# EAGLE design ArduinoShield (EAGLE 7.3.0)
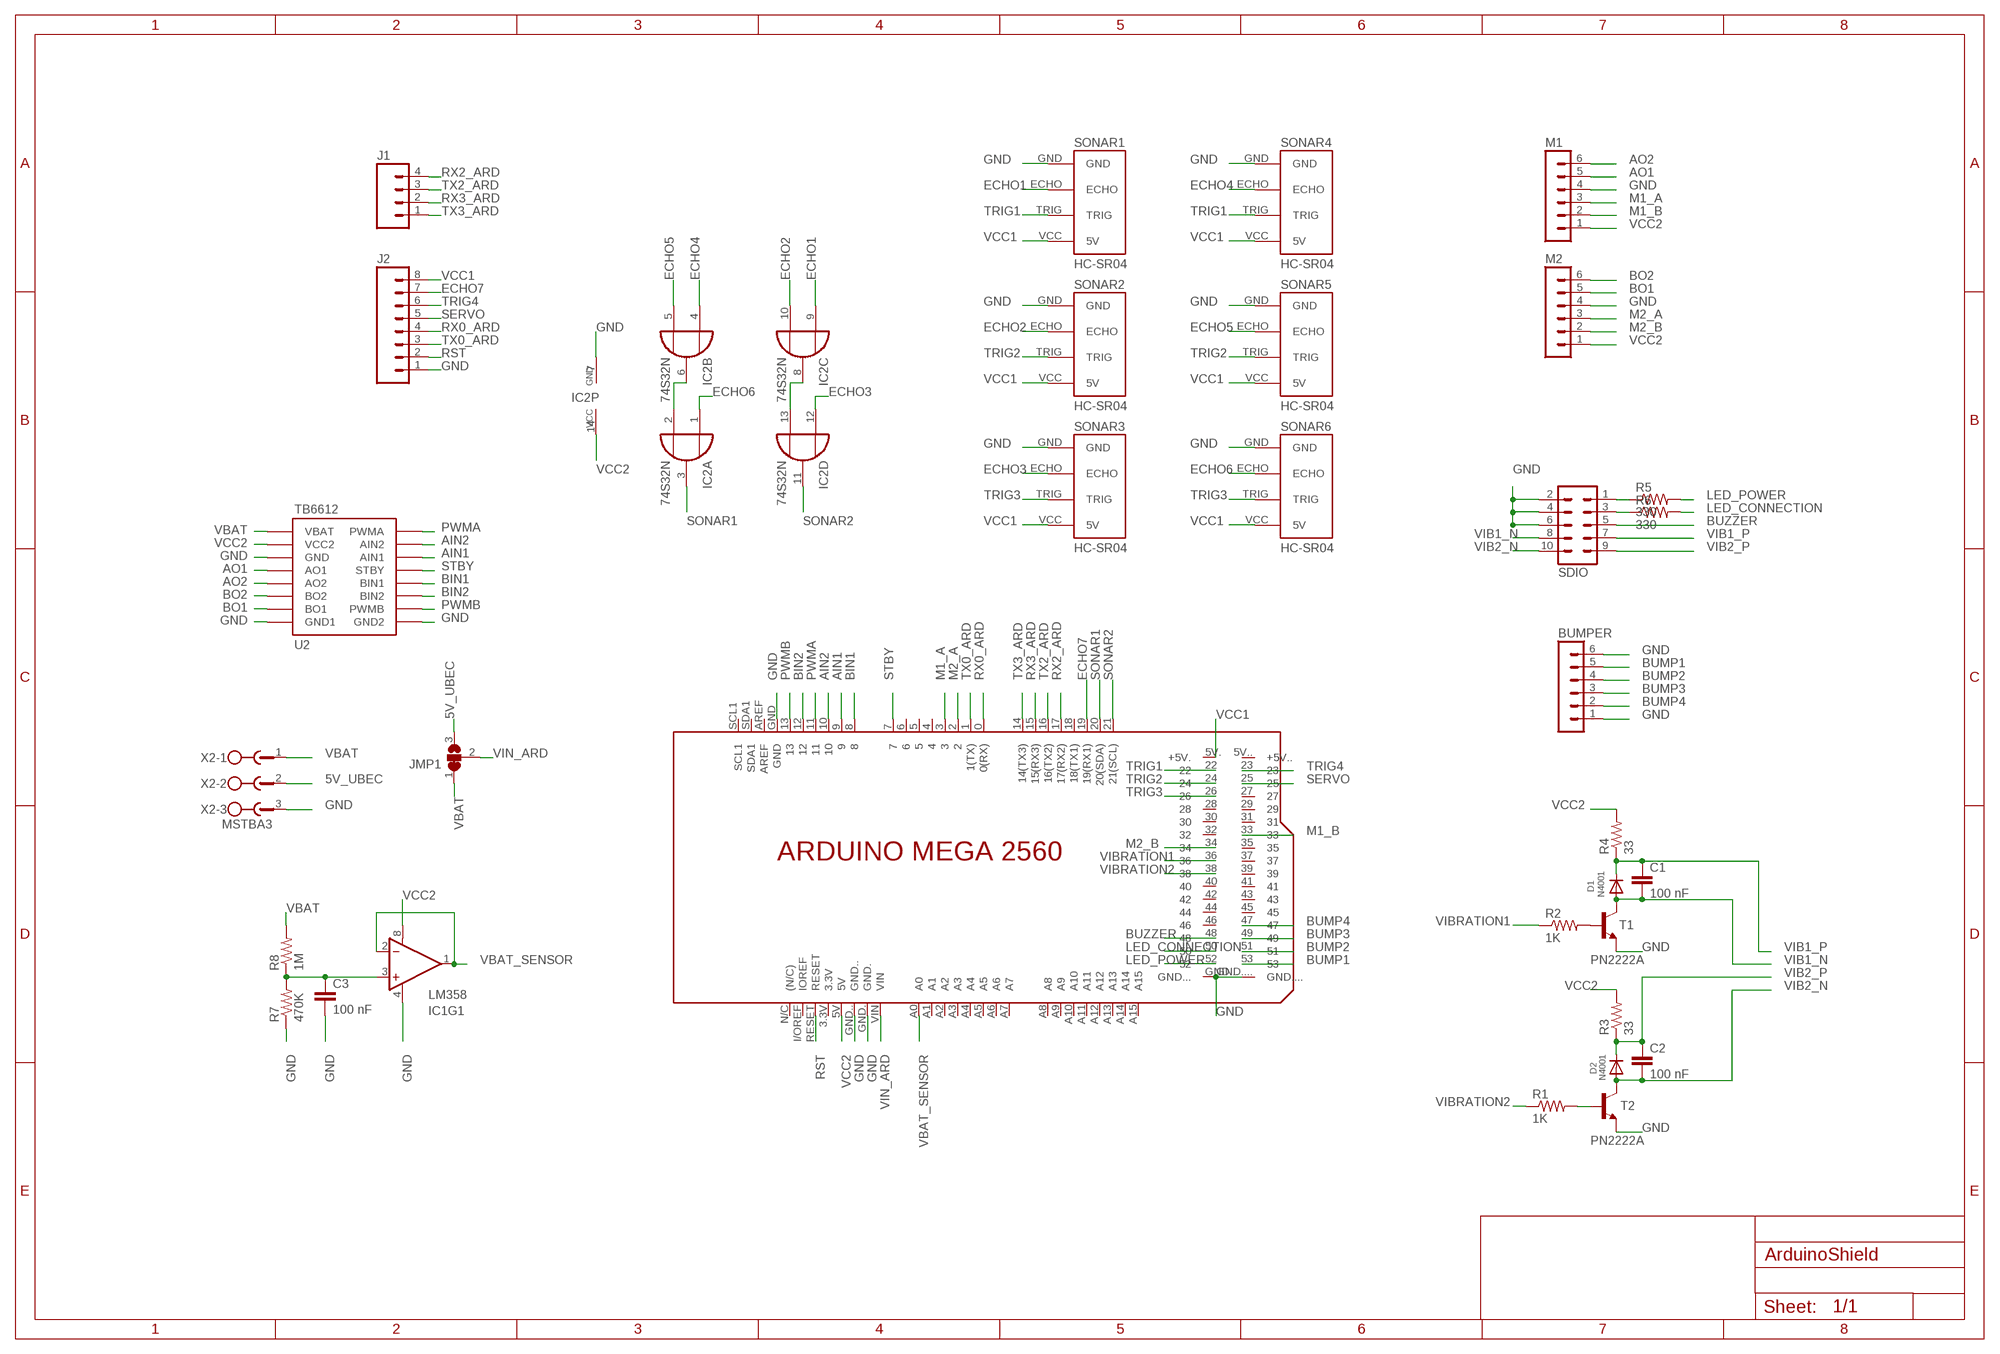
[diagram p0: schematic, sheet 1]

## Parts
BUMPER  MA06-1  [MA06-1]
C1  100 nF  C5/2.5  [C5B2.5]
C2  100 nF  C5/2.5  [C5B2.5]
C3  100 nF  C5/2.5  [C5B2.5]
D1  N4001  DIODEDO-1N4148  [DO-1N4148]
D2  N4001  DIODEDO-1N4148  [DO-1N4148]
IC1  LM358  [DIP08]
IC2  74S32N  [DIL14]
J1  M04PTH  [1X04]
J2  M08SILK_FEMALE_PTH  [1X08]
JMP1  SJ2W  [SJ_2]
M1  MA06-1  [MA06-1]
M2  MA06-1  [MA06-1]
PCB1  ARDUINO_MEGA2560  [ARDUINO_MEGA2560]
R1  1K  R-US_0207/2V  [0207/2V]
R2  1K  R-US_0207/2V  [0207/2V]
R3  33  R-US_0207/2V  [0207/2V]
R4  33  R-US_0207/2V  [0207/2V]
R5  330  R-US_0207/2V  [0207/2V]
R6  330  R-US_0207/2V  [0207/2V]
R7  470K  R-US_0207/2V  [0207/2V]
R8  1M  R-US_0207/2V  [0207/2V]
SDIO  MA05-2  [MA05-2]
SONAR1  HC-SR04  [HC-SR04_FOOTPRINT]
SONAR2  HC-SR04  [HC-SR04_FOOTPRINT]
SONAR3  HC-SR04  [HC-SR04_FOOTPRINT]
SONAR4  HC-SR04  [HC-SR04_FOOTPRINT]
SONAR5  HC-SR04  [HC-SR04_FOOTPRINT]
SONAR6  HC-SR04  [HC-SR04_FOOTPRINT]
T1  PN2222A  2N2222  [TO92-EBC-OVAL]
T2  PN2222A  2N2222  [TO92-EBC-OVAL]
U2  TB6612  [TB6612]
X2  MSTBA3  [MSTBA3]

## Nets
5V_UBEC: JMP1.3 X2.2
AIN1: PCB1.9 U2.P$14(AIN1)
AIN2: PCB1.10 U2.P$15(AIN2)
AO1: M1.5 U2.P$4(AO1)
AO2: M1.6 U2.P$5(AO2)
BIN1: PCB1.8 U2.P$12(BIN1)
BIN2: PCB1.12 U2.P$11(BIN2)
BO1: M2.5 U2.P$7(BO1)
BO2: M2.6 U2.P$6(BO2)
BUMP1: BUMPER.5 PCB1.53
BUMP2: BUMPER.4 PCB1.51
BUMP3: BUMPER.3 PCB1.49
BUMP4: BUMPER.2 PCB1.47
BUZZER: PCB1.48 SDIO.5
ECHO1: IC2.9(C:I0) SONAR1.ECHO
ECHO2: IC2.10(C:I1) SONAR2.ECHO
ECHO3: IC2.12(D:I0) SONAR3.ECHO
ECHO4: IC2.4(B:I0) SONAR4.ECHO
ECHO5: IC2.5(B:I1) SONAR5.ECHO
ECHO6: IC2.1(A:I0) SONAR6.ECHO
ECHO7: J2.7 PCB1.19(19(RX1))
GND: BUMPER.1 BUMPER.6 C3.2 IC1.4(V-) IC2.7(P:GND) J2.1 M1.4 M2.4 PCB1.GND PCB1.GND. PCB1.GND.. PCB1.GND... PCB1.GND.... R7.1 SDIO.2 SDIO.4 SDIO.6 SONAR1.GND SONAR2.GND SONAR3.GND SONAR4.GND SONAR5.GND SONAR6.GND T1.E T2.E U2.P$3(GND) U2.P$8(GND1) U2.P$9(GND2) X2.3
LED_CONNECTION: PCB1.50 R6.2
LED_POWER: PCB1.52 R5.2
M1_A: M1.3 PCB1.3
M1_B: M1.2 PCB1.33
M2_A: M2.3 PCB1.2
M2_B: M2.2 PCB1.34
N$1: R2.2 T1.B
N$4: IC2.2(A:I1) IC2.6(B:O)
N$5: R1.2 T2.B
N$8: IC2.8(C:O) IC2.13(D:I1)
N$11: R5.1 SDIO.1
N$12: R6.1 SDIO.3
N$13: C3.1 IC1.3(+IN) R7.2 R8.1
PWMA: PCB1.11 U2.P$16(PWMA)
PWMB: PCB1.13 U2.P$10(PWMB)
RST: J2.2 PCB1.RESET
RX0_ARD: J2.4 PCB1.0(0(RX))
RX2_ARD: J1.4 PCB1.17(17(RX2))
RX3_ARD: J1.2 PCB1.15(15(RX3))
SERVO: J2.5 PCB1.25
SONAR1: IC2.3(A:O) PCB1.20(20(SDA))
SONAR2: IC2.11(D:O) PCB1.21(21(SCL))
STBY: PCB1.7 U2.P$13(STBY)
TRIG1: PCB1.22 SONAR1.TRIG SONAR4.TRIG
TRIG2: PCB1.24 SONAR2.TRIG SONAR5.TRIG
TRIG3: PCB1.26 SONAR3.TRIG SONAR6.TRIG
TRIG4: J2.6 PCB1.23
TX0_ARD: J2.3 PCB1.1(1(TX))
TX2_ARD: J1.3 PCB1.16(16(TX2))
TX3_ARD: J1.1 PCB1.14(14(TX3))
VBAT: JMP1.1 R8.2 U2.P$1(VBAT) X2.1
VBAT_SENSOR: IC1.1(OUT) IC1.2(-IN) PCB1.A0
VCC1: J2.8 PCB1.5V.(+5V.) SONAR1.VCC(5V) SONAR2.VCC(5V) SONAR3.VCC(5V) SONAR4.VCC(5V) SONAR5.VCC(5V) SONAR6.VCC(5V)
VCC2: IC1.8(V+) IC2.14(P:VCC) M1.1 M2.1 PCB1.5V R3.2 R4.2 U2.P$2(VCC2)
VIB1_N: C1.2 D1.A SDIO.8 T1.C
VIB1_P: C1.1 D1.C R4.1 SDIO.7
VIB2_N: C2.2 D2.A SDIO.10 T2.C
VIB2_P: C2.1 D2.C R3.1 SDIO.9
VIBRATION1: PCB1.36 R2.1
VIBRATION2: PCB1.38 R1.1
VIN_ARD: JMP1.2 PCB1.VIN
Unconnected: IC1.5(+IN) IC1.6(-IN) IC1.7(OUT) PCB1.3.3V PCB1.4 PCB1.5 PCB1.5V..(+5V..) PCB1.6 PCB1.18(18(TX1)) PCB1.27 PCB1.28 PCB1.29 PCB1.30 PCB1.31 PCB1.32 PCB1.35 PCB1.37 PCB1.39 PCB1.40 PCB1.41 PCB1.42 PCB1.43 PCB1.44 PCB1.45 PCB1.46 PCB1.A1 PCB1.A2 PCB1.A3 PCB1.A4 PCB1.A5 PCB1.A6 PCB1.A7 PCB1.A8 PCB1.A9 PCB1.A10 PCB1.A11 PCB1.A12 PCB1.A13 PCB1.A14 PCB1.A15 PCB1.AREF PCB1.I/OREF(IOREF) PCB1.N/C((N/C)) PCB1.SCL1 PCB1.SDA1

## Library data of the parts
BUMPER M1 M2 = con-lstb:MA06-1: PIN HEADER; OC_FARNELL: unknown; OC_NEWARK: unknown
C1-C3 = capacitor-wima:C: CAPACITOR naming: grid - package width
D1 D2 = adafruit:DIODE: Diode SMADIODE - SMA Surface Mount Package 20V 1A Schottky Diode Digikey: 641-1014-6-ND DO-1N4148 - Through Hole Small Current Diode SOD-123 20V 1 A (.5mV Vf) Schottky Diode - Digikey: MBRX120TPMSCT-ND SOD-323 10V 570mA (.38mV Vf, 3ns) Schottky Diode - Digikey: ZLLS410CT-ND SOD-523 30V 30mA Schottky Diode (RB751S-40TE61) - Digikey: RB751S-40TE61CT-ND SOT23-R/W - SOT23 Package (R = Solder Paste/Reflow Ovens, W = Hand-Soldering) BAT54Film 40V 300mA - Digikey: 497-7162-1-ND
IC1 = SparkFun-AnalogIC:LM358: Jellybean op-amp; PROD_ID: IC-09172
IC2 = 74xx-eu:74*32: Quad 2-input OR gate
J1 = SparkFun-Connectors:M04: Header 4 Standard 4-pin 0.1" header. Use with straight break away headers (SKU : PRT-00116), right angle break away headers (PRT-00553), swiss pins (PRT-00743), machine pins (PRT-00117), and female headers (PRT-00115). Molex polarized connector foot print use with SKU : PRT-08231 with associated crimp pins and housings. 1MM SMD Version SKU: PRT-10208
J2 = SparkFun-Connectors:M08: Header 8 Standard 8-pin 0.1" header. Use with straight break away headers (SKU : PRT-00116), right angle break away headers (PRT-00553), swiss pins (PRT-00743), machine pins (PRT-00117), and female headers (PRT-00115).; PROD_ID: CONN-08438
JMP1 = jumper:SJ2W: SMD solder JUMPER
PCB1 = E14_Arduino_revB:ARDUINO_MEGA2560: Device for representing an Arduino Mega 2560 board with a footprint in an EAGLE design. Created by Dave Young for Element14. More EAGLE documentation at: http://www.element14.com/community/community/knode/cadsoft_eagle
R1-R8 = adafruit:R-US_: RESISTOR, American symbol
SDIO = con-lstb:MA05-2: PIN HEADER; OC_FARNELL: unknown; OC_NEWARK: unknown
SONAR1-SONAR6 = Ultrasonic Sensor HC-SR04:HC-SR04: Ultrasonic Sensor HC-SR04
T1 T2 = adafruit:2N2222: NPN TRANSISTOR Big oval pads
U2 = tb6612:TB6612
X2 = con-phoenix-508:MSTBA3: PHOENIX; MF: FARNELL; MPN: 1757255; OC_FARNELL: 3705183; OC_NEWARK: 71C4162

## Board
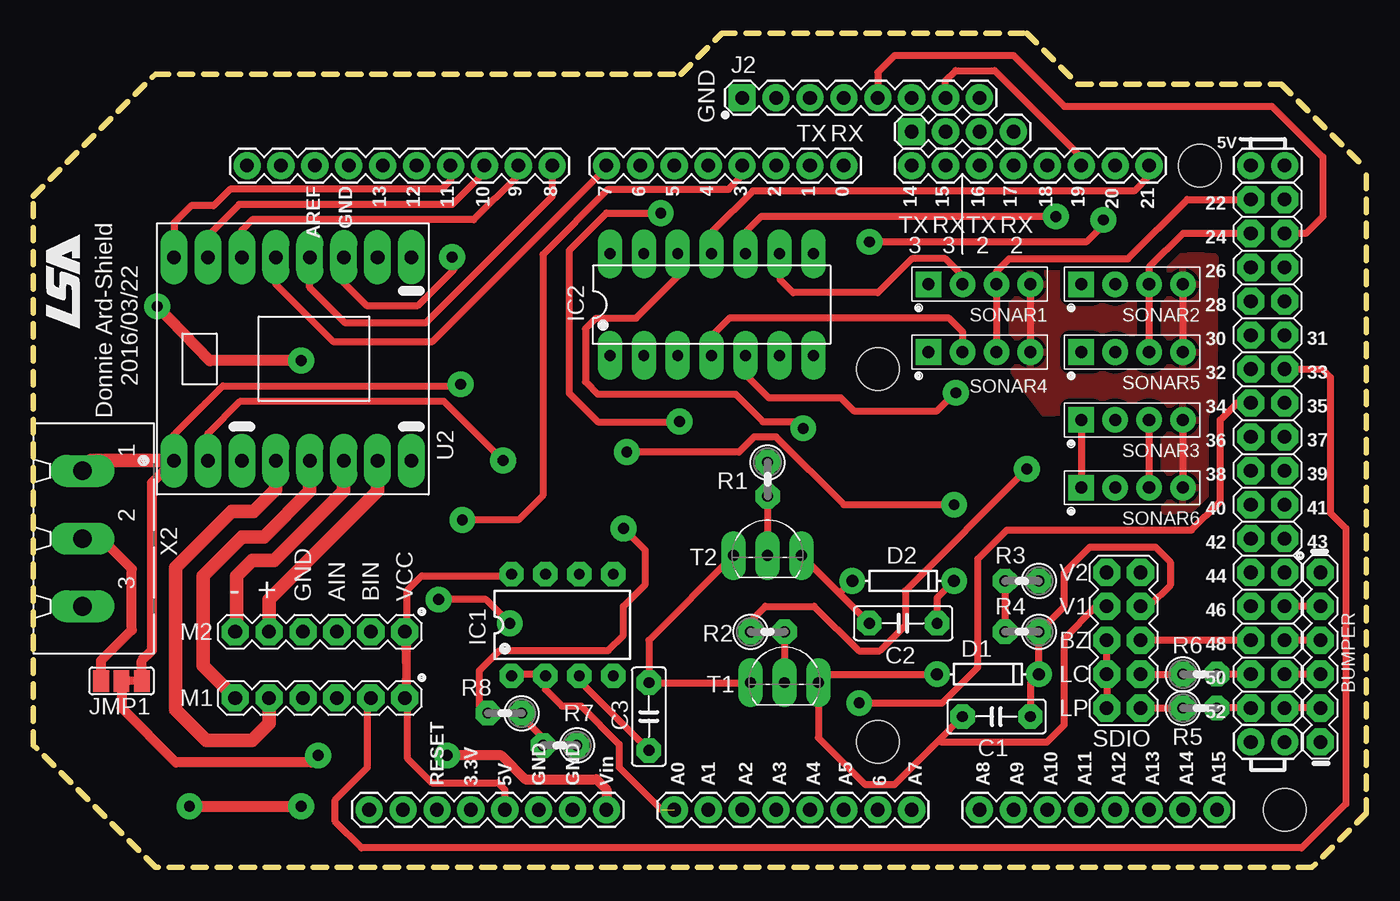
[diagram p1: board, top side]
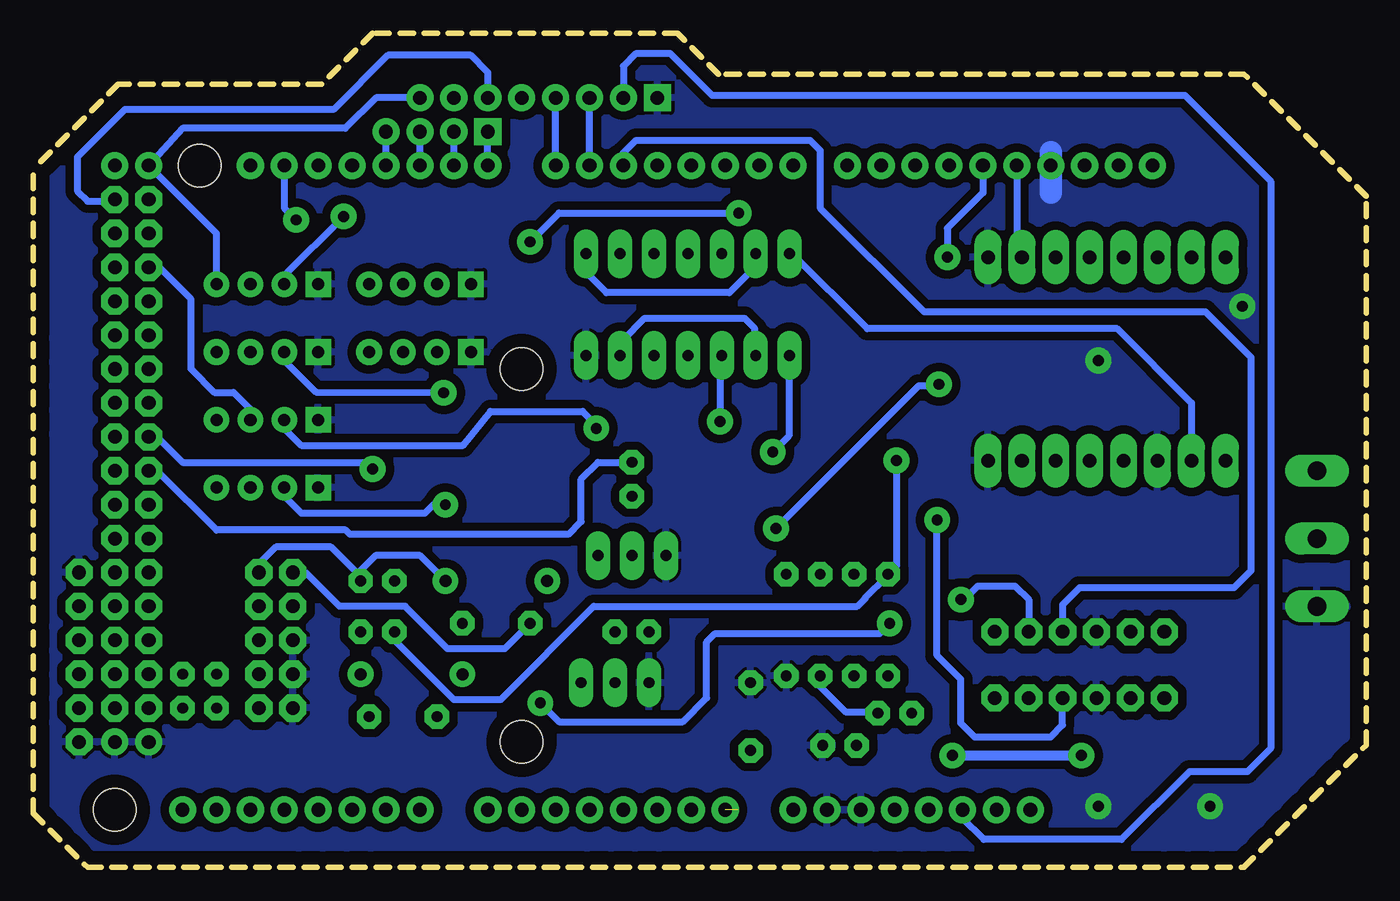
[diagram p2: board, bottom side, seen from below]

Size 99.82 x 62.48 mm. Coordinates in mm from the lower left corner, seen from the top.
Outline: 51.56,62.48 74.42,62.48 78.23,58.67 93.47,58.67 99.82,52.32 99.82,4.06 95.76,0 9.14,0 0,9.14 0,50.29 9.14,59.44 48.51,59.44 51.56,62.48
Copper layers (1*16): Top 0.035mm / dielectric 1.5mm / Bottom 0.035mm
Design rules "default *": minimum track width 20mil, minimum drill 24mil, track to track 25mil, track to pad 25mil, pad to pad 20mil, via to via 20mil, smd to smd 20mil, copper to edge 40mil, drill to drill 8mil, minimum pad ring 20mil, minimum via ring 8mil, stop-mask expansion 4mil, vias tented up to drill 0mil, thermal gap 10mil

### Footprints (pad centres in the part's own frame; a part is rotated, then mirrored left to right if it is on the bottom)
MA06-1 = drill 1.016 pad 1.93 octagon: 1 -6.35,0; 2 -3.81,0; 3 -1.27,0; 4 1.27,0; 5 3.81,0; 6 6.35,0
C5B2.5 = drill 0.813 pad 1.6 octagon: 1 -2.54,0; 2 2.54,0
DO-1N4148 = drill 0.9: A -3.81,0; C 3.81,0
DIP08 = drill 0.813 pad 1.727 octagon: 1 -3.81,-3.81; 2 -1.27,-3.81; 3 1.27,-3.81; 4 3.81,-3.81; 5 3.81,3.81; 6 1.27,3.81; 7 -1.27,3.81; 8 -3.81,3.81
DIL14 = drill 0.813 long: 1 -7.62,-3.81; 2 -5.08,-3.81; 3 -2.54,-3.81; 4 0,-3.81; 5 2.54,-3.81; 6 5.08,-3.81; 7 7.62,-3.81; 8 7.62,3.81; 9 5.08,3.81; 10 2.54,3.81; 11 0,3.81; 12 -2.54,3.81; 13 -5.08,3.81; 14 -7.62,3.81
1X04 = drill 1.016 pad 1.88 square: 1 0,0 | drill 1.016 pad 1.88: 2 2.54,0; 3 5.08,0; 4 7.62,0
1X08 = drill 1.016 pad 1.88 square: 1 0,0 | drill 1.016 pad 1.88: 2 2.54,0; 3 5.08,0; 4 7.62,0; 5 10.16,0; 6 12.7,0; 7 15.24,0; 8 17.78,0
SJ_2 = smd 1.168 x 1.6: 1 -1.524,0; 2 0,0; 3 1.524,0
ARDUINO_MEGA2560 = drill 1.016 pad 1.88: 0 63.5,50.8; 1 60.96,50.8; 2 58.42,50.8; 3 55.88,50.8; 3.3V 35.56,2.54; 4 53.34,50.8; 5 50.8,50.8; 5V 38.1,2.54; 5V. 93.98,50.8; 5V.. 96.52,50.8; 6 48.26,50.8; 7 45.72,50.8; 8 41.656,50.8; 9 39.116,50.8; 10 36.576,50.8; 11 34.036,50.8; 12 31.496,50.8; 13 28.956,50.8; 14 68.58,50.8; 15 71.12,50.8; 16 73.66,50.8; 17 76.2,50.8; 18 78.74,50.8; 19 81.28,50.8; 20 83.82,50.8; 21 86.36,50.8; A0 50.8,2.54; A1 53.34,2.54; A2 55.88,2.54; A3 58.42,2.54; A4 60.96,2.54; A5 63.5,2.54; A6 66.04,2.54; A7 68.58,2.54; A8 73.66,2.54; A9 76.2,2.54; A10 78.74,2.54; A11 81.28,2.54; A12 83.82,2.54; A13 86.36,2.54; A14 88.9,2.54; A15 91.44,2.54; AREF 23.876,50.8; GND 26.416,50.8; GND. 43.18,2.54; GND.. 40.64,2.54; GND... 93.98,7.62; GND.... 96.52,7.62; I/OREF 30.48,2.54; N/C 27.94,2.54; RESET 33.02,2.54; SCL1 18.796,50.8; SDA1 21.336,50.8; VIN 45.72,2.54 | drill 1.016 pad 1.88 octagon: 22 93.98,48.26; 23 96.52,48.26; 24 93.98,45.72; 25 96.52,45.72; 26 93.98,43.18; 27 96.52,43.18; 28 93.98,40.64; 29 96.52,40.64; 30 93.98,38.1; 31 96.52,38.1; 32 93.98,35.56; 33 96.52,35.56; 34 93.98,33.02; 35 96.52,33.02; 36 93.98,30.48; 37 96.52,30.48; 38 93.98,27.94; 39 96.52,27.94; 40 93.98,25.4; 41 96.52,25.4; 42 93.98,22.86; 43 96.52,22.86; 44 93.98,20.32; 45 96.52,20.32; 46 93.98,17.78; 47 96.52,17.78; 48 93.98,15.24; 49 96.52,15.24; 50 93.98,12.7; 51 96.52,12.7; 52 93.98,10.16; 53 96.52,10.16 | hole 3.2: 66.04,35.56; 66.04,7.62; 90.17,50.8; 96.52,2.54
0207/2V = drill 0.813 pad 1.676 octagon: 1 -1.27,0; 2 1.27,0
MA05-2 = drill 1.016 octagon: 1 -5.08,-1.27; 2 -5.08,1.27; 3 -2.54,-1.27; 4 -2.54,1.27; 5 0,-1.27; 6 0,1.27; 7 2.54,-1.27; 8 2.54,1.27; 9 5.08,-1.27; 10 5.08,1.27
HC-SR04_FOOTPRINT = drill 0.9 pad 1.778: ECHO 0,1.27; TRIG 0,-1.27; VCC 0,-3.81 | drill 0.9 pad 1.778 square: GND 0,3.81
TO92-EBC-OVAL = drill 0.813 long: B 0,-1.27; C 2.54,-1.27; E -2.54,-1.27
TB6612 = drill 1.016 pad 2.032 long: P$1 0,0; P$2 0,-2.54; P$3 0,-5.08; P$4 0,-7.62; P$5 0,-10.16; P$6 0,-12.7; P$7 0,-15.24; P$8 0,-17.78; P$9 15.24,-17.78; P$10 15.24,-15.24; P$11 15.24,-12.7; P$12 15.24,-10.16; P$13 15.24,-7.62; P$14 15.24,-5.08; P$15 15.24,-2.54; P$16 15.24,0
MSTBA3 = drill 1.397 long: 1 -5.08,5.08; 2 0,5.08; 3 5.08,5.08

### Placement (x,y rotation side)
BUMPER  96.39,15.75 270 top
C1  72.14,11.3 180 top
C2  65.15,18.29 180 top
C3  46.1,11.3 90 top
D1  71.5,14.48 0 top
D2  65.15,21.46 0 top
IC1  39.62,18.16 0 top
IC2  50.8,42.16 0 top
J1  65.79,55.12 0 top
J2  53.09,57.66 0 top
JMP1  6.6,13.97 180 top
M1  21.46,12.7 180 top
M2  21.46,17.65 180 top
PCB1  -2.79,1.78 0 top
R1  54.99,29.08 270 top
R2  54.99,17.65 0 top
R3  74.04,21.46 180 top
R4  74.04,17.65 180 top
R5  87.38,11.94 0 top
R6  87.38,14.48 0 top
R7  39.43,9.14 180 top
R8  35.31,11.56 180 top
SDIO  81.66,17.02 90 top
SONAR1  70.87,43.69 90 top
SONAR2  82.3,43.69 90 top
SONAR3  82.3,33.53 90 top
SONAR4  70.87,38.61 90 top
SONAR5  82.3,38.61 90 top
SONAR6  82.3,28.45 90 top
T1  56.26,15.11 0 top
T2  54.99,24.64 0 top
U2  10.54,30.48 90 top
X2  -1.4,24.64 270 top

### Tracks (layer width: path | path; a pad name or v marks a point on that pad's centre or on a via)
5V_UBEC
  Top 0.762: JMP1.3 5.08,15.49 7.37,17.78 7.37,22.35 5.08,24.64 X2.2
AIN1
  Top 0.508: U2.P$14 15.62,47.75 16.38,48.51 32.99,48.51 36.26,51.78 36.26,52.52 PCB1.9
AIN2
  Top 0.508: PCB1.10 33.78,52.07 31.37,49.66 15.4,49.66 13.08,47.34 U2.P$15
AO1
  Top 1.016: U2.P$4 18.16,28.32 16.51,26.67 14.86,26.67 10.67,22.48 10.67,11.81 12.95,9.52 16.38,9.52 17.65,10.8 M1.5
AO2
  Top 1.016: U2.P$5 20.7,28.19 17.27,24.76 15.62,24.76 12.7,21.84 12.7,15.11 M1.6
BIN1
  Top 0.508: U2.P$12 20.7,43.43 23.3,40.83 29.43,40.83 38.86,50.26 PCB1.8
BIN2  (via drill 0.81 pad 1.93)
  Top 0.508: U2.P$11 23.24,43.81 24.96,42.1 28.8,42.1 31.5,44.8 31.5,45.59 v31.37,45.72
  Bottom 0.508: PCB1.12 28.7,50.55 31.37,47.88 v31.37,45.72
BO1
  Top 1.016: U2.P$7 25.78,28.19 17.65,20.07 M2.5
BO2
  Top 1.016: U2.P$6 23.24,28.19 18.03,22.99 16.38,22.99 15.24,21.84 15.24,17.78 M2.6
BUMP1
  Top 0.508: BUMPER.5 PCB1.53
BUMP2
  Top 0.508: BUMPER.4 PCB1.51
BUMP3
  Top 0.508: BUMPER.3 PCB1.49
BUMP4
  Top 0.508: BUMPER.2 PCB1.47
BUZZER
  Top 0.508: PCB1.48 SDIO.5
ECHO1
  Top 0.508: SONAR1.ECHO 69.6,44.32 68.33,45.59 65.79,45.59 63.25,43.05 56.9,43.05 55.94,44.01 55.94,45.91 IC2.9
ECHO2  (via drill 0.81 pad 1.93)
  Top 0.508: v76.58,48.77 54.52,48.77 53.4,47.66 53.4,46.23 IC2.10
  Bottom 0.508: v76.58,48.77 81.03,44.32 SONAR2.ECHO
ECHO3  (via drill 0.81 pad 1.93)
  Top 0.508: v57.66,32.89 57.15,33.4 54.64,33.4 52.61,35.43 42.29,35.43 41.34,36.39 41.34,40.35 42.13,41.15 45.15,41.15 48.32,44.32 48.32,45.91 IC2.12
  Bottom 0.508: SONAR3.ECHO 81.03,32.89 79.76,31.62 67.63,31.62 65.59,34.16 58.67,34.16 57.66,33.15 v57.66,32.89
ECHO4
  Top 0.508: IC2.4 50.86,38.61 50.86,39.88 52.13,41.15 68.58,41.15 69.6,40.13 SONAR4.ECHO
ECHO5  (via drill 0.81 pad 1.93)
  Top 0.508: v69.09,35.56 67.63,34.16 61.5,34.16 60.48,35.18 55.09,35.18 53.4,36.86 53.4,38.29 IC2.5
  Bottom 0.508: SONAR5.ECHO 81.03,37.97 78.68,35.62 v69.09,35.56
ECHO6  (via drill 0.81 pad 1.93)
  Top 0.508: 68.71,27.18 v68.96,27.18 60.71,27.18 55.63,32.26 53.98,32.26 52.83,31.11 v44.45,31.11
  Bottom 0.508: SONAR6.ECHO 81.03,27.81 79.76,26.54 70.48,26.54 69.85,27.18 v68.96,27.18 | IC2.1 43.24,38.29 43.24,32.32 v44.45,31.11
ECHO7
  Top 0.508: PCB1.19 78.49,53.21 72.01,59.69 69.09,59.69 68.33,58.93 J2.7
GND  (via drill 0.81 pad 1.93)
  Top 0.508: SONAR3.GND SONAR6.GND | SDIO.2 SDIO.4 SDIO.6 | T1.E C3.2 46.1,17.02 T2.E
  Top 0.813: v11.68,4.57 v20.07,4.57 | v20.07,37.97 13.21,37.97 v9.27,42.04
  Bottom 1.676: 23.62,53.59 PCB1.GND 23.62,50.55
  pour Bottom: 0.1,50.2 0.25,9.14 9.14,0.25 95.76,0.25 99.57,4.19 99.57,26.29 98.55,27.31 98.55,53.21 93.34,58.45 78.11,58.52 74.39,62.26 51.72,62.23 48.64,59.21 9.14,59.18
LED_CONNECTION
  Top 0.508: PCB1.50 R6.2
LED_POWER
  Top 0.508: PCB1.52 R5.2
M1_A  (via drill 0.81 pad 1.93)
  Top 0.508: PCB1.3 53.09,51.82 52.07,50.8 43.05,50.8 38.16,45.91 38.16,27.88 36.32,26.04 v32.13,26.04
  Bottom 0.508: M1.3 22.73,10.67 23.62,9.78 29.34,9.78 30.35,10.8 30.35,14.1 32.13,15.88 v32.13,26.04
M1_B
  Top 0.508: PCB1.33 96.52,37.34 97.16,36.7 97.16,26.54 98.3,25.4 98.3,4.76 95,1.46 24.57,1.46 22.61,3.43 22.61,5.08 25.02,7.49 25.02,12.45 M1.2
M2_A
  Bottom 0.508: M2.3 22.73,19.68 21.46,20.96 9.91,20.96 8.64,22.22 8.64,38.23 12.03,41.62 33.12,41.62 40.89,49.4 40.89,53.72 41.66,54.48 54.67,54.48 55.63,53.53 PCB1.2
M2_B  (via drill 0.81 pad 1.93)
  Top 0.508: v61.85,12.32 68.07,12.32 70.74,14.99 70.74,23.11 72.9,25.27 86.74,25.27 88.9,27.43 88.9,33.53 90.17,34.8 PCB1.34 | v35.69,18.29 33.91,20.07 v30.35,20.07
  Bottom 0.508: 25.27,18.41 M2.2 25.27,20.07 26.29,21.08 29.08,21.08 30.1,20.07 v30.35,20.07 | v61.85,12.32 60.45,10.92 51.18,10.92 49.4,12.7 49.4,16.89 48.77,17.53 36.45,17.53 v35.69,18.29
N$1
  Top 0.508: R2.2 T1.B
N$4
  Bottom 0.508: IC2.2 45.78,38.61 45.78,40.35 46.58,41.15 54.04,41.15 55.63,39.56 55.63,38.61 IC2.6
N$5
  Top 0.508: R1.2 T2.B
N$8
  Bottom 0.508: IC2.13 45.78,45.91 45.78,44.96 47.69,43.05 56.9,43.05 58.17,44.32 58.17,45.91 IC2.8
N$11
  Top 0.508: SDIO.1 R5.1
N$12
  Top 0.508: SDIO.3 R6.1
N$13
  Top 0.508: R7.2 38.16,9.71 36.58,11.3 R8.1 | C3.1 40.89,13.97 IC1.3
  Bottom 0.508: R8.1 36.58,11.62 38.96,11.62 40.89,13.56 IC1.3
PWMA
  Top 0.508: PCB1.11 31.24,51.44 30.61,50.8 14.73,50.8 13.49,49.56 11.81,49.56 10.54,48.29 U2.P$16
PWMB
  Bottom 0.508: PCB1.13 26.16,46.1 U2.P$10
RST
  Bottom 0.508: PCB1.RESET 30.23,3.68 28.64,2.1 18.32,2.1 13.24,7.18 8.89,7.18 7.14,8.92 7.14,51.4 13.56,57.82 48.96,57.82 52.13,60.99 54.67,60.99 55.63,60.04 J2.2
RX0_ARD
  Bottom 0.508: PCB1.0 J2.4
RX2_ARD
  Bottom 0.508: PCB1.17 J1.4
RX3_ARD
  Bottom 0.508: PCB1.15 J1.2
SERVO
  Top 0.508: PCB1.25 95.31,47.5 96.58,48.77 96.58,53.21 92.77,57.02 77.22,57.02 73.41,60.83 64.52,60.83 63.25,59.56 J2.5
SONAR1  (via drill 0.81 pad 1.93)
  Top 0.508: v46.99,49.02 42.93,49.02 40.13,46.23 40.13,35.53 42.29,33.37 48.36,33.37 v48.39,33.4 | v80.14,48.51 80.14,48.13 78.87,46.86 v62.61,46.86
  Bottom 0.508: IC2.3 48.39,38.23 v48.39,33.4 | v46.99,49.02 60.45,49.02 v62.61,46.86 | PCB1.20 81.03,49.4 v80.14,48.51
SONAR2
  Top 0.508: IC2.11 50.86,46.23 50.86,47.66 53.88,50.67 82.45,50.67 83.57,51.78 PCB1.21
STBY
  Top 0.508: U2.P$13 18.16,43.69 22.45,39.4 29.91,39.4 42.45,51.94 42.45,52.1 PCB1.7
TRIG1
  Top 0.508: SONAR4.TRIG SONAR1.TRIG 72.14,44.64 73.09,45.59 81.98,45.59 86.42,50.04 PCB1.22
TRIG2
  Top 0.508: SONAR5.TRIG SONAR2.TRIG 83.57,44.96 86.11,47.5 PCB1.24
TRIG3
  Top 0.508: SONAR3.TRIG SONAR6.TRIG
  Bottom 0.508: PCB1.26 90.39,44.96 88.01,42.58 88.01,37.34 86.27,35.59 84.84,35.59 83.57,34.32 SONAR3.TRIG
TRIG4
  Bottom 0.508: PCB1.23 93.85,49.91 95.76,49.91 96.52,50.67 96.52,53.21 92.96,56.77 77.34,56.77 73.28,60.83 67.06,60.83 65.79,59.56 J2.6
TX0_ARD
  Bottom 0.508: PCB1.1 J2.3
TX2_ARD
  Bottom 0.508: PCB1.16 J1.3
TX3_ARD
  Bottom 0.508: PCB1.14 J1.1
VBAT  (via drill 0.81 pad 1.93)
  Top 0.508: v32,36.19 31.88,36.07 14.19,36.07 10.54,32.42 U2.P$1 | v44.2,25.4 45.85,23.75 45.85,21.21 44.2,19.56 44.2,17.4 43.05,16.26 34.93,16.26 33.4,14.73 33.4,12.1 33.94,11.56 R8.2
  Top 0.762: JMP1.1 8.13,15.49 8.89,16.26 8.89,28.83 U2.P$1
  Top 1.016: X2.1 4.32,30.48 U2.P$1
  Bottom 0.508: v44.2,25.4 33.53,36.07 32.13,36.07 v32,36.19
VBAT_SENSOR  (1 unrouted)
  Top 0.508: IC1.1 35.94,14.48 38.16,14.48 IC1.2 38.35,13.34 39.59,12.1 41.02,12.1 43.88,9.24 43.88,7.49 47.05,4.32
VCC1
  Top 0.508: SONAR3.VCC SONAR6.VCC | SONAR1.VCC SONAR4.VCC | SONAR2.VCC SONAR5.VCC
  Bottom 0.508: J2.8 74.17,57.66 76.45,55.37 88.65,55.37 PCB1.5V. 86.11,47.5 SONAR2.VCC
  pour Top: 73.28,44.96 73.28,37.34 74.17,36.07 75.69,34.04 84.2,34.42 84.71,26.67 87.63,26.92 88.39,26.92 88.52,45.72 87.25,45.85 73.41,45.21
VCC2  (via drill 0.81 pad 1.93)
  Top 0.508: R3.2 R4.2 | 35.62,21.78 IC1.8 35.69,21.84 29.08,21.84 28,20.76 28,17.65 M1.1 28,17.34 28,12.89 | 28,12.89 M2.1 | 28,12.89 28,8.19 29.85,6.35 34.8,6.35 35.31,5.84 PCB1.5V | U2.P$2 13.08,32.51 15.49,34.92 30.73,34.92 v35.18,30.48
  Bottom 0.508: 42.93,45.91 IC2.14 42.99,45.97 37.37,40.35 18.64,40.35 13.08,34.8 U2.P$2 | R4.2 72.77,17.02 68.33,12.57 64.83,12.57 57.85,19.56 38.1,19.56 37.53,20.13 37.53,20.19 35.94,21.78 IC1.8 35.18,22.61 v35.18,30.48
VIB1_N
  Top 0.508: 67.85,9.56 64.52,6.22 62.29,6.22 58.8,9.71 T1.C 59.44,14.48 D1.A | 67.85,9.56 C1.2 | 67.85,9.56 68.01,9.4 75.95,9.4 77.22,10.67 77.22,17.18 79.6,19.56 SDIO.8
VIB1_P
  Top 0.508: C1.1 74.68,13.84 D1.C R4.1 77.22,19.56 77.22,22.1 79.12,24 84.04,24 85.15,22.89 85.15,21.15 83.57,19.56 SDIO.7
VIB2_N
  Top 0.508: T2.C 60.39,20.51 | 60.39,20.51 C2.2 | 60.39,20.51 D2.A
  Bottom 0.508: C2.2 64.52,16.38 68.8,16.38 71.98,19.56 76.9,19.56 79.44,22.1 SDIO.10
VIB2_P
  Top 0.508: C2.1 67.69,20.19 D2.C
  Bottom 0.508: D2.C 70.87,23.37 74.2,23.37 75.55,22.02 | 75.55,22.02 75.31,21.78 R3.1 | 75.55,22.02 77.53,24 81.66,24 82.93,22.73 SDIO.9
VIBRATION1  (via drill 0.81 pad 1.93)
  Top 0.508: v74.42,29.85 65.31,20.73 65.31,18.13 63.41,16.22 61.82,16.22 58.48,19.56 54.83,19.56 53.72,18.45 R2.1
  Bottom 0.508: v74.42,29.85 74.93,30.35 88.65,30.35 90.55,32.26 PCB1.36
VIBRATION2
  Bottom 0.508: PCB1.38 90.55,29.72 86.11,25.27 76.42,25.27 76.11,24.96 59.75,24.96 58.8,25.91 58.8,29.08 57.53,30.35 R1.1
VIN_ARD  (via drill 0.82 pad 1.93)
  Top 0.508: 7.87,13.97 JMP1.2
  Top 0.762: JMP1.2 6.6,11.94 10.67,7.87 20.83,7.87 v21.34,8.38 | PCB1.VIN 42.93,5.84 42.16,6.6 36.83,6.6 35.05,8.38 v30.99,8.38
  Bottom 0.762: v30.99,8.38 v21.34,8.38

### Text on the board
tNames: GND | TX | RX | TX | RX | TX | RX | 3 | 3 | 2 | 2 | Donnie Ard-Shield / 2016/03/22 | V2 | - | + | GND | AIN | BIN | VCC | V1 | BZ | LC | LP